# EAGLE design SparkFun Qwiic Adapter (EAGLE 7.7.0)
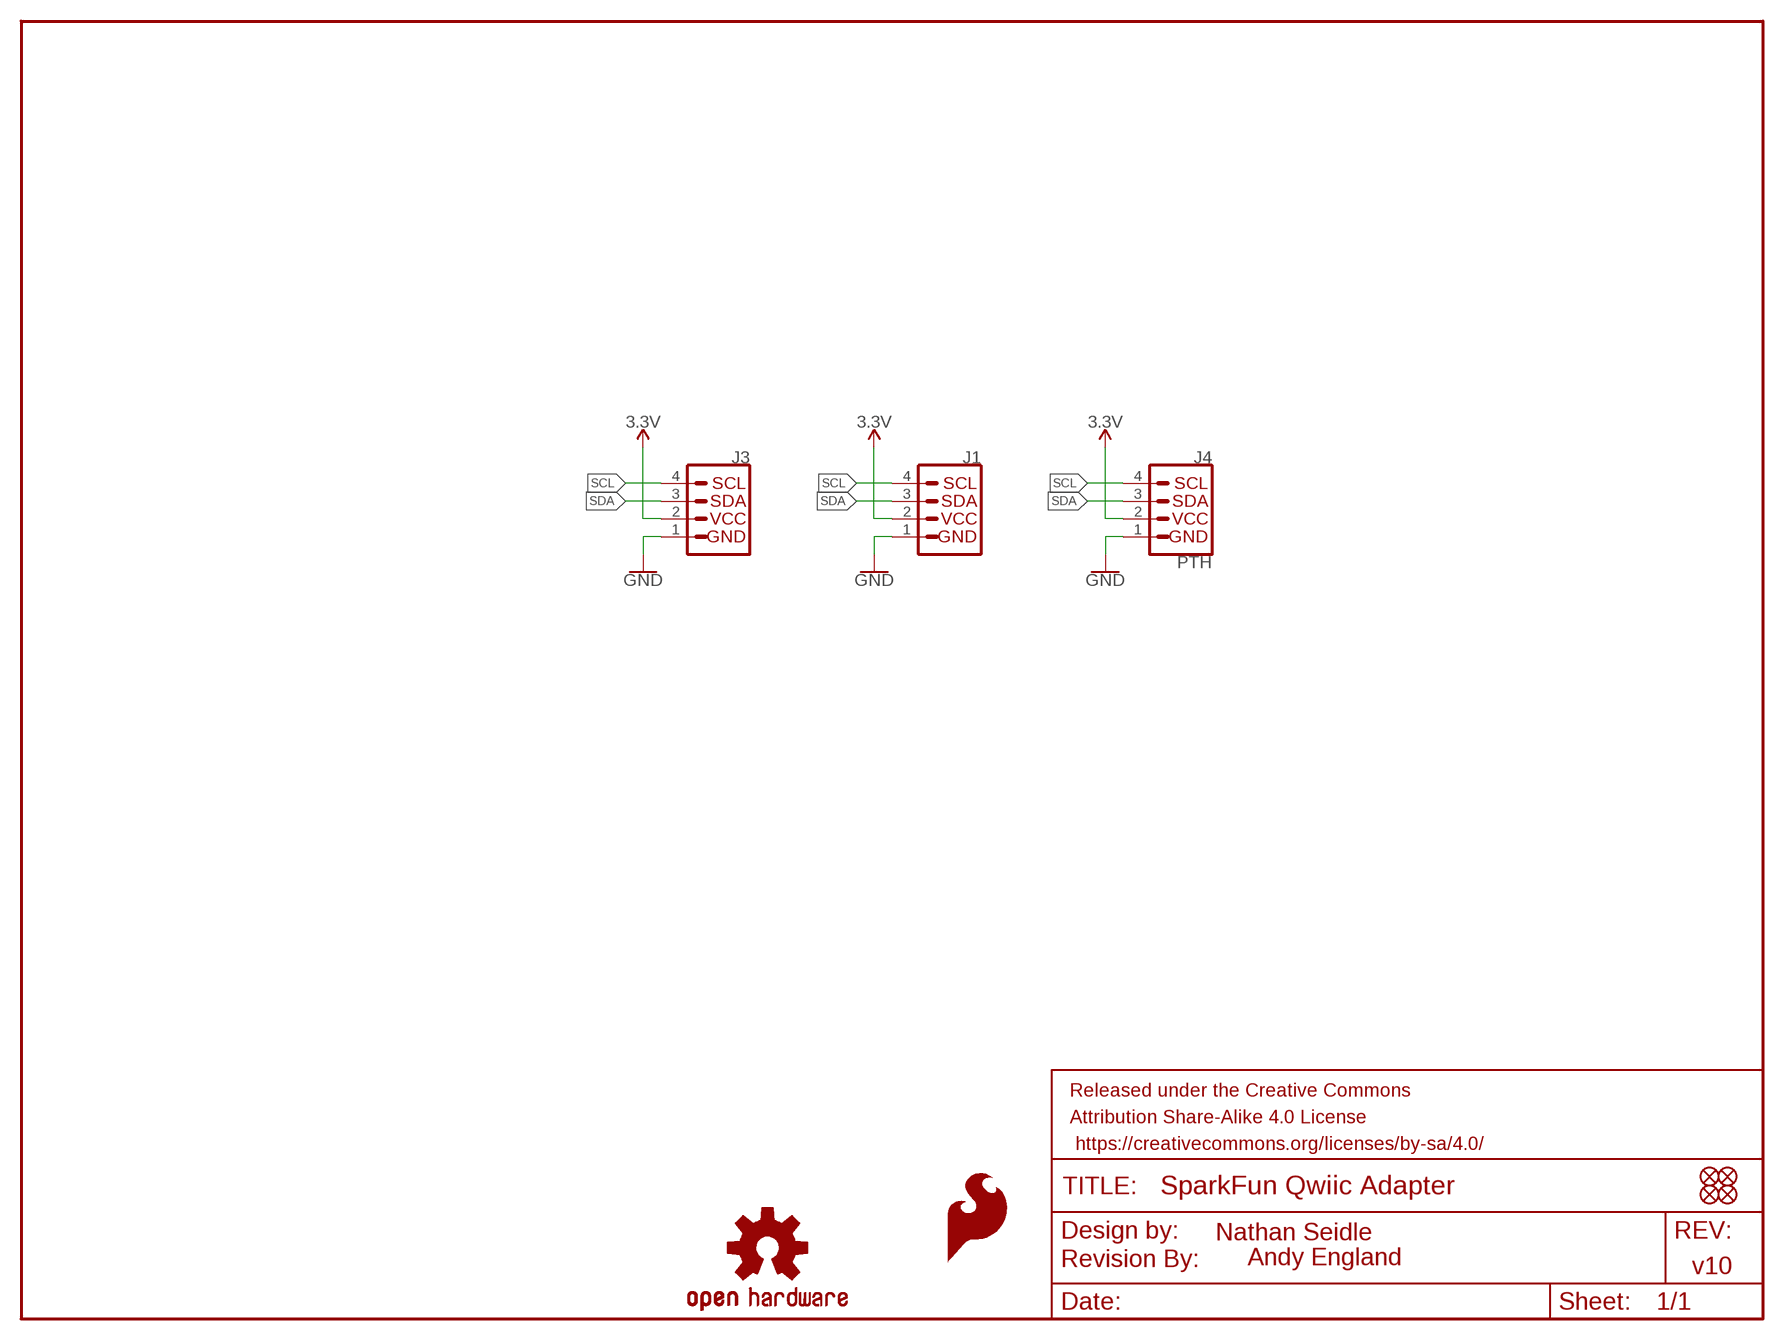
[diagram p0: schematic, sheet 1]

## Parts
FD1  FIDUCIALUFIDUCIAL  [FIDUCIAL-MICRO]
FD2  FIDUCIALUFIDUCIAL  [FIDUCIAL-MICRO]
FD3  FIDUCIALUFIDUCIAL  [FIDUCIAL-MICRO]
FD4  FIDUCIALUFIDUCIAL  [FIDUCIAL-MICRO]
FRAME1  FRAME-LETTER  [CREATIVE_COMMONS]
J1  QWIIC_CONNECTORJS-1MM  [1X04_1MM_RA]
J3  QWIIC_CONNECTORJS-1MM  [1X04_1MM_RA]
J4  PTH  I2C_STANDARD  [1X04]
LOGO1  REVISION  [REVISION]
LOGO4  OSHW-LOGOS  [OSHW-LOGO-S]
U$1  SFE_LOGO_FLAME.1_INCH  [SFE_LOGO_FLAME_.1]

## Nets
3.3V: J1.2 J3.2 J4.2
GND: J1.1 J3.1 J4.1
SCL: J1.4 J3.4 J4.4
SDA: J1.3 J3.3 J4.3

## Notes on the sheet
- Nathan Seidle
- Andy England | v10

## Library data of the parts
FD1-FD4 = SparkFun-Aesthetics:FIDUCIAL: Fiducial Alignment Points Point-of-reference for pick-and-place machines and other optical instruments.
FRAME1 = SparkFun-Aesthetics:FRAME-LETTER: Schematic Frame - Letter Standard 8.5x11 US Letter frame
J1 J3 = SparkFun-Connectors:QWIIC_CONNECTOR: SparkFun I2C Standard Qwiic Connector An SMD 1mm pitch JST connector makes it easy and quick (get it? Qwiic?) to connect I2C devices to each other. The Qwiic system <http://www.sparkfun.com/qwiic> enables fast and solderless connection between popular platforms and various sensors and actuators. We carry 200mm <https://www.sparkfun.com/products/14204>, 100mm <https://www.sparkfun.com/products/14205>, 50mm <https://www.sparkfun.com/products/14206>, and breadboard friendly <https://www.sparkfun.com/products/14207> Qwiic cables. We also offer 10 pcs strips <https://www.sparkfun.com/products/14323> the SMD connectors.; PROD_ID: CONN-13694
J4 = SparkFun-Connectors:I2C_STANDARD: SparkFun I2C Standard Pinout Header SparkFun has standardized on a pinout for all I2C based sensor breakouts. This pinout allows I2C boards to be plugged directly into the headers on Arduino Uno compatible boards, and to be daisy chained easily. Example SparkFun Products: SparkFun Atmospheric Sensor Breakout - BME280 <https://www.sparkfun.com/products/13676> SparkFun Altitude/Pressure Sensor Breakout - MPL3115A2 <https://www.sparkfun.com/products/11084> SparkFun TOF Range Finder Sensor - VL6180 <https://www.sparkfun.com/products/12785>
LOGO1 = SparkFun-Aesthetics:REVISION: "Revision By" Text Preceding text for revisor documentation. Includes schematic text on "symbols" layer, and board text on tDoc.
LOGO4 = SparkFun-Aesthetics:OSHW-LOGO: Open-Source Hardware (OSHW) Logo This logo indicates the piece of hardware it is found on incorporates a OSHW license and/or adheres to the definition of open source hardware found here: http://freedomdefined.org/OSHW
U$1 = SparkFun-Aesthetics:SFE_LOGO_FLAME: SparkFun Flame Logo This is the SparkFun flame logo. The logo on the schematic will always be the same size; the package variant is the height of the flame. Default layer for the logo on the board is tSilk.

## Board
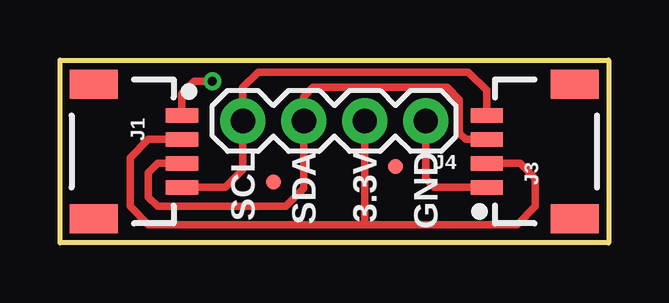
[diagram p1: board, top side]
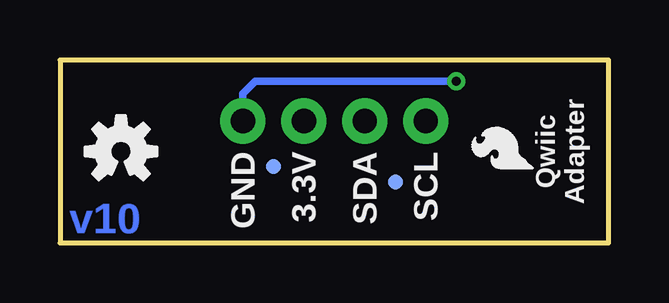
[diagram p2: board, bottom side, seen from below]

Size 22.86 x 7.62 mm. Coordinates in mm from the lower left corner, seen from the top.
Outline: 0,0 0,7.62 22.86,7.62 22.86,0 0,0
Copper layers (1*16): Top 0.035mm / dielectric 1.5mm / Bottom 0.035mm
Design rules "SparkFun-2-layer-TIGHT": minimum track width 7mil, minimum drill 15mil, track to track 7mil, track to pad 7mil, pad to pad 7mil, via to via 7mil, smd to smd 7mil, copper to edge 7mil, drill to drill 7mil, minimum pad ring 7mil, minimum via ring 7mil, stop-mask expansion 4mil, vias tented up to drill 25mil, thermal gap 10mil

### Footprints (pad centres in the part's own frame; a part is rotated, then mirrored left to right if it is on the bottom)
FIDUCIAL-MICRO = smd 0.635 x 0.635: 1 0,0
1X04_1MM_RA = smd 0.6 x 1.35: 1 -1.5,0; 2 -0.5,0; 3 0.5,0; 4 1.5,0 | smd 1.2 x 2: NC1 2.8,-3.675; NC2 -2.8,-3.675
1X04 = drill 1.016 pad 1.88: 1 0,0; 2 2.54,0; 3 5.08,0; 4 7.62,0

### Placement (x,y rotation side)
FD1  8.89,2.54 0 top
FD2  8.89,2.54 0 bottom
FD3  13.97,3.17 0 top
FD4  13.97,3.17 0 bottom
FRAME1  -16.51,-8.89 0 top  (outside the outline)
J1  5.08,3.81 270 top
J3  17.78,3.81 90 top
J4  15.24,5.08 180 top
LOGO1  -5.08,-11.43 0 top  (outside the outline)
LOGO4  20.32,3.81 0 bottom
U$1  2.79,2.79 90 bottom

### Tracks (layer width: path | path; a pad name or v marks a point on that pad's centre or on a via)
3.3V
  Top 0.305: J1.2 3.67,4.31 2.92,3.56 2.92,1.52 3.68,0.76 12.7,0.76 | 12.7,0.76 19.05,0.76 19.81,1.52 19.81,2.67 19.17,3.31 J3.2 | J4.2 12.7,3.3 | 12.71,3.31 12.7,3.3 | 12.7,3.3 12.7,0.76
GND  (via drill 0.38)
  Top 0.305: J3.1 15.6,2.31 15.24,2.67 J4.1 | J1.1 5.08,6.22 5.59,6.73 v6.35,6.73
  Bottom 0.305: v6.35,6.73 14.73,6.73 15.24,6.22 J4.1
SCL
  Top 0.305: J3.4 17.78,6.35 17.02,7.11 8.26,7.11 7.62,6.48 J4.4 7.62,3.05 6.88,2.31 J1.4
SDA
  Top 0.305: J3.3 16.9,4.31 16.64,4.57 16.64,5.97 16.13,6.48 10.54,6.48 10.16,6.1 J4.3 10.16,2.29 9.4,1.52 4.06,1.52 3.68,1.91 3.68,2.92 4.07,3.31 J1.3

### Text on the board
Bottom: v10
tPlace: SCL | SDA | 3.3V | GND
bPlace: Qwiic / Adapter | SCL | SDA | 3.3V | GND
Measures: Measurements in Inches
tDocu: Nathan Seidle | Andy England